# Altium schematic sheet 8.5 WIFI&BT.SchDoc: 6.6kW Daul OBC +11kW WPT
size 508 x 355 mm; Revision: V 1.0; SheetNumber: 13; SheetTotal: 14; ImagePath: 0
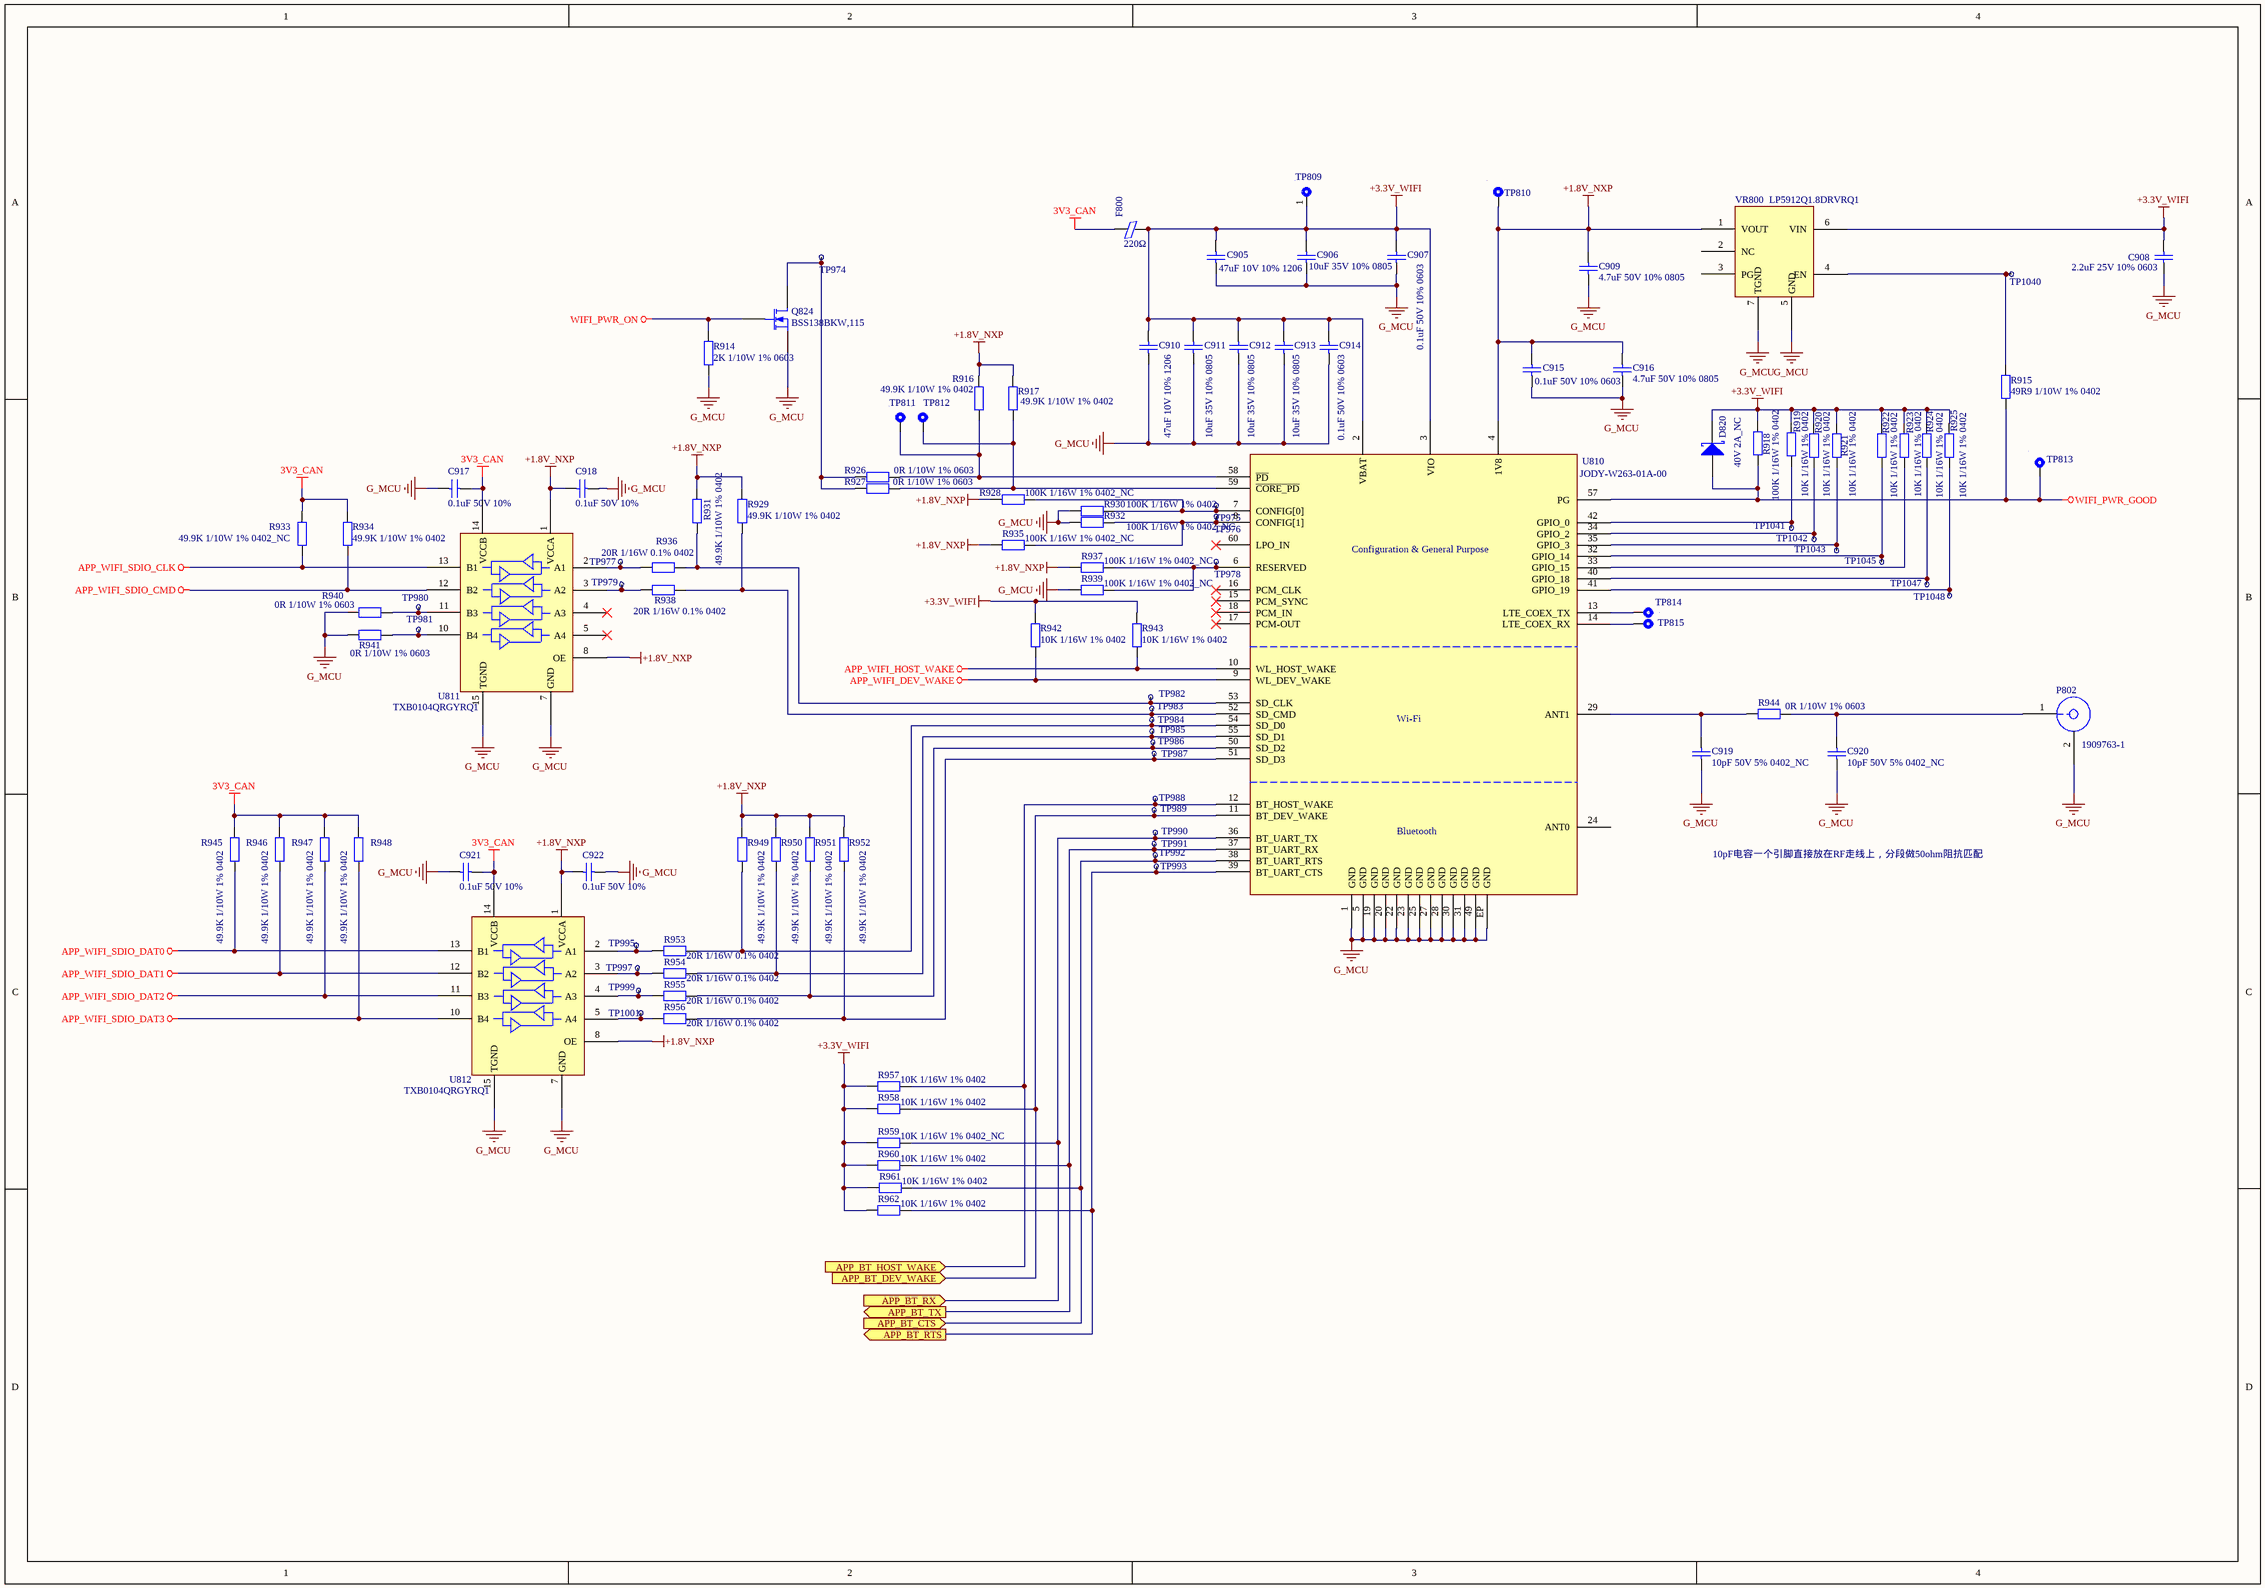
[diagram p0: 8.5 WIFI&BT.SchDoc]

## Parts
C905  47uF 10V 10% 1206  [C1206]
C906  10uF 35V 10% 0805  [C0805]
C907  0.1uF 50V 10% 0603  [C0603]
C908  2.2uF 25V 10% 0603  [C0603]
C909  4.7uF 50V 10% 0805  [C0805]
C910  47uF 10V 10% 1206  [C1206]
C911  10uF 35V 10% 0805  [C0805]
C912  10uF 35V 10% 0805  [C0805]
C913  10uF 35V 10% 0805  [C0805]
C914  0.1uF 50V 10% 0603  [C0603]
C915  0.1uF 50V 10% 0603  [C0603]
C916  4.7uF 50V 10% 0805  [C0805]
C917  0.1uF 50V 10%  [C0603]
C918  0.1uF 50V 10%  [C0603]
C919  10pF 50V 5% 0402_NC  [C0402]
C920  10pF 50V 5% 0402_NC  [C0402]
C921  0.1uF 50V 10%  [C0603]
C922  0.1uF 50V 10%  [C0603]
D820  40V 2A_NC  [SOD123_FL]
F800  值: 220Ω  [R0603]  (hidden comment: 220)
P802  1909763-1  [TE_1909763-1]
Q824  BSS138BKW,115  [SOT323]
R914  2K 1/10W 1% 0603  [R0603]
R915  49R9 1/10W 1% 0402  [R0402]
R916  49.9K 1/10W 1% 0402  [R0402]
R917  49.9K 1/10W 1% 0402  [R0402]
R918  100K 1/16W 1% 0402  [R0402]
R919  10K 1/16W 1% 0402  [R0402]
R920  10K 1/16W 1% 0402  [R0402]
R921  10K 1/16W 1% 0402  [R0402]
R922  10K 1/16W 1% 0402  [R0402]
R923  10K 1/16W 1% 0402  [R0402]
R924  10K 1/16W 1% 0402  [R0402]
R925  10K 1/16W 1% 0402  [R0402]
R926  0R 1/10W 1% 0603  [R0603]
R927  0R 1/10W 1% 0603  [R0603]
R928  100K 1/16W 1% 0402_NC  [R0402]
R929  49.9K 1/10W 1% 0402  [R0402]
R930  100K 1/16W 1% 0402  [R0402]
R931  49.9K 1/10W 1% 0402  [R0402]
R932  100K 1/16W 1% 0402_NC  [R0402]
R933  49.9K 1/10W 1% 0402_NC  [R0402]
R934  49.9K 1/10W 1% 0402  [R0402]
R935  100K 1/16W 1% 0402_NC  [R0402]
R936  20R 1/16W 0.1% 0402  [R0402]
R937  100K 1/16W 1% 0402_NC  [R0402]
R938  20R 1/16W 0.1% 0402  [R0402]
R939  100K 1/16W 1% 0402_NC  [R0402]
R940  0R 1/10W 1% 0603  [R0603]
R941  0R 1/10W 1% 0603  [R0603]
R942  10K 1/16W 1% 0402  [R0402]
R943  10K 1/16W 1% 0402  [R0402]
R944  0R 1/10W 1% 0603  [R0603]
R945  49.9K 1/10W 1% 0402  [R0402]
R946  49.9K 1/10W 1% 0402  [R0402]
R947  49.9K 1/10W 1% 0402  [R0402]
R948  49.9K 1/10W 1% 0402  [R0402]
R949  49.9K 1/10W 1% 0402  [R0402]
R950  49.9K 1/10W 1% 0402  [R0402]
R951  49.9K 1/10W 1% 0402  [R0402]
R952  49.9K 1/10W 1% 0402  [R0402]
R953  20R 1/16W 0.1% 0402  [R0402]
R954  20R 1/16W 0.1% 0402  [R0402]
R955  20R 1/16W 0.1% 0402  [R0402]
R956  20R 1/16W 0.1% 0402  [R0402]
R957  10K 1/16W 1% 0402  [R0402]
R958  10K 1/16W 1% 0402  [R0402]
R959  10K 1/16W 1% 0402_NC  [R0402]
R960  10K 1/16W 1% 0402  [R0402]
R961  10K 1/16W 1% 0402  [R0402]
R962  10K 1/16W 1% 0402  [R0402]
TP809  测试点  [测试点]  (value not drawn)
TP810  测试点  [测试点]  (value not drawn)
TP811  测试点  [测试点]  (value not drawn)
TP812  测试点  [测试点]  (value not drawn)
TP813  测试点  [测试点]  (value not drawn)
TP814  测试点  [测试点]  (value not drawn)
TP815  测试点  [测试点]  (value not drawn)
TP974  测试点  [测试点]  (value not drawn)
TP975  测试点  [测试点]  (value not drawn)
TP976  测试点  [测试点]  (value not drawn)
TP977  测试点  [测试点]  (value not drawn)
TP978  测试点  [测试点]  (value not drawn)
TP979  测试点  [测试点]  (value not drawn)
TP980  测试点  [测试点]  (value not drawn)
TP981  测试点  [测试点]  (value not drawn)
TP982  测试点  [测试点]  (value not drawn)
TP983  测试点  [测试点]  (value not drawn)
TP984  测试点  [测试点]  (value not drawn)
TP985  测试点  [测试点]  (value not drawn)
TP986  测试点  [测试点]  (value not drawn)
TP987  测试点  [测试点]  (value not drawn)
TP988  测试点  [测试点]  (value not drawn)
TP989  测试点  [测试点]  (value not drawn)
TP990  测试点  [测试点]  (value not drawn)
TP991  测试点  [测试点]  (value not drawn)
TP992  测试点  [测试点]  (value not drawn)
TP993  测试点  [测试点]  (value not drawn)
TP995  测试点  [测试点]  (value not drawn)
TP997  测试点  [测试点]  (value not drawn)
TP999  测试点  [测试点]  (value not drawn)
TP1001  测试点  [测试点]  (value not drawn)
TP1040  测试点  [测试点]  (value not drawn)
TP1041  测试点  [测试点]  (value not drawn)
TP1042  测试点  [测试点]  (value not drawn)
TP1043  测试点  [测试点]  (value not drawn)
TP1045  测试点  [测试点]  (value not drawn)
TP1047  测试点  [测试点]  (value not drawn)
TP1048  测试点  [测试点]  (value not drawn)
U810  JODY-W263-01A-00  [UBLOX_JODY-W263]
U811  TXB0104QRGYRQ1  [TI_VQFN-14_RGY]
U812  TXB0104QRGYRQ1  [TI_VQFN-14_RGY]
VR800  LP5912Q1.8DRVRQ1  [TI_WSON-6_DRV]

## Ports
APP_BT_CTS (in), APP_BT_DEV_WAKE (in), APP_BT_HOST_WAKE (in), APP_BT_RTS (out), APP_BT_RX (in), APP_BT_TX (out)

## Nets
3V3_CAN: C917.2 C921.2 F800.1 R933.2 R934.2 R945.2 R946.2 R947.2 R948.2 U811.14(VCCB) U812.14(VCCB)
+1.8V_NXP: C909.2 C915.2 C916.2 C918.1 C922.1 R916.2 R917.2 R928.2 R929.2 R931.2 R935.2 R937.2 R949.2 R950.2 R951.2 R952.2 TP810.1 U810.4(1V8) U811.1(VCCA) U811.8(OE) U812.1(VCCA) U812.8(OE) VR800.1(VOUT)
+3.3V_WIFI: C905.2 C906.2 C907.2 C908.2 C910.2 C911.2 C912.2 C913.2 C914.2 D820.K F800.2 R918.1 R919.2 R920.2 R921.2 R922.2 R923.2 R924.2 R925.2 R942.2 R943.2 R957.2 R958.2 R959.2 R960.2 R961.2 R962.2 TP809.1 U810.2(VBAT) U810.3(VIO) VR800.6(VIN)
APP_WIFI_DEV_WAKE: R942.1 U810.9(WL_DEV_WAKE)
APP_WIFI_HOST_WAKE: R943.1 U810.10(WL_HOST_WAKE)
APP_WIFI_SDIO_CLK: R933.1 U811.13(B1)
APP_WIFI_SDIO_CMD: R934.1 U811.12(B2)
APP_WIFI_SDIO_DAT0: R945.1 U812.13(B1)
APP_WIFI_SDIO_DAT1: R946.1 U812.12(B2)
APP_WIFI_SDIO_DAT2: R947.1 U812.11(B3)
APP_WIFI_SDIO_DAT3: R948.1 U812.10(B4)
G_MCU: C905.1 C906.1 C907.1 C908.1 C909.1 C910.1 C911.1 C912.1 C913.1 C914.1 C915.1 C916.1 C917.1 C918.2 C919.1 C920.1 C921.1 C922.2 P802.2 Q824.S R914.2 R930.2 R932.2 R939.2 R940.2 R941.2 U810.1(GND) U810.5(GND) U810.19(GND) U810.20(GND) U810.22(GND) U810.23(GND) U810.25(GND) U810.27(GND) U810.28(GND) U810.30(GND) U810.31(GND) U810.49(GND) U810.EP(GND) U811.7(GND) U811.15(TGND) U812.7(GND) U812.15(TGND) VR800.5(GND) VR800.7(TGND)
WIFI_PWR_GOOD: D820.A R915.2 R918.2 TP813.1 U810.57(PG)
WIFI_PWR_ON: Q824.G R914.1
APP_BT_CTS: R961.1 TP992.1 U810.38(BT_UART_RTS) ; port APP_BT_CTS
APP_BT_DEV_WAKE: R958.1 TP989.1 U810.11(BT_DEV_WAKE) ; port APP_BT_DEV_WAKE
APP_BT_HOST_WAKE: R957.1 TP988.1 U810.12(BT_HOST_WAKE) ; port APP_BT_HOST_WAKE
APP_BT_RTS: R962.1 TP993.1 U810.39(BT_UART_CTS) ; port APP_BT_RTS
APP_BT_RX: R959.1 TP990.1 U810.36(BT_UART_TX) ; port APP_BT_RX
APP_BT_TX: R960.1 TP991.1 U810.37(BT_UART_RX) ; port APP_BT_TX
NetC919_2: C919.2 R944.1 U810.29(ANT1)
NetC920_2: C920.2 P802.1 R944.2
NetQ824_D: Q824.D R926.2 R927.2 TP974.1
NetR915_1: R915.1 TP1040.1 VR800.4(EN)
NetR916_1: R916.1 R926.1 TP811.1 U810.58(~{PD})
NetR917_1: R917.1 R927.1 TP812.1 U810.59(~{CORE_PD})
NetR919_1: R919.1 TP1041.1 U810.42(GPIO_0)
NetR920_1: R920.1 TP1042.1 U810.34(GPIO_2)
NetR921_1: R921.1 TP1043.1 U810.35(GPIO_3)
NetR922_1: R922.1 TP1045.1 U810.32(GPIO_14)
NetR923_1: R923.1 U810.33(GPIO_15)
NetR924_1: R924.1 TP1047.1 U810.40(GPIO_18)
NetR925_1: R925.1 TP1048.1 U810.41(GPIO_19)
NetR928_1: R928.1 R930.1 TP975.1 U810.7(CONFIG[0])
NetR929_1: R929.1 R938.1 TP983.1 U810.52(SD_CMD)
NetR931_1: R931.1 R936.1 TP982.1 U810.53(SD_CLK)
NetR932_1: R932.1 R935.1 TP976.1 U810.8(CONFIG[1])
NetR936_2: R936.2 TP977.1 U811.2(A1)
NetR937_1: R937.1 R939.1 TP978.1 U810.6(RESERVED)
NetR938_2: R938.2 TP979.1 U811.3(A2)
NetR940_1: R940.1 TP980.1 U811.11(B3)
NetR941_1: R941.1 TP981.1 U811.10(B4)
NetR949_1: R949.1 R953.1 TP984.1 U810.54(SD_D0)
NetR950_1: R950.1 R954.1 TP985.1 U810.55(SD_D1)
NetR951_1: R951.1 R955.1 TP986.1 U810.50(SD_D2)
NetR952_1: R952.1 R956.1 TP987.1 U810.51(SD_D3)
NetR953_2: R953.2 TP995.1 U812.2(A1)
NetR954_2: R954.2 TP997.1 U812.3(A2)
NetR955_2: R955.2 TP999.1 U812.4(A3)
NetR956_2: R956.2 TP1001.1 U812.5(A4)
NetTP814_1: TP814.1 U810.13(LTE_COEX_TX)
NetTP815_1: TP815.1 U810.14(LTE_COEX_RX)

Not connected (* = marked no-connect by the designer): U810 15(PCM_SYNC)* 16(PCM_CLK)* 17(PCM-OUT)* 18(PCM_IN)* 24(ANT0) 60(LPO_IN)*; U811 4(A3)* 5(A4)*; VR800 2(NC) 3(PG)

## Notes on the sheet
- 10pF电容一个引脚直接放在RF走线上，分段做50ohm阻抗匹配
- PROJECT
- SIZE
- APPROVER
- TITLE
- A3
- REV.
- ENGINEER
- DATE
- SHEET
- of
- XCTR-ARD-006(1)-1
- (in symbol JODY-W263-01A-00) Configuration & General Purpose; Wi-Fi; Bluetooth

## Library data of the parts
C905 C910 = Cap Semi: CAP CER 47uF 10V 10% X5R 1206 SMD; 厂商: Murata; 料号: GRM31CR61A476KE15L
C906 = Cap Semi: CAP CER 10uF 35V 10% X5R 0805 SMD; 厂商: CL21A106KBYQNNE; 料号: SAMSUNG
C907 C914 C915 = Cap Semi: CAP CER 0.1uF 50V 10% X7R 0603 SMD; 厂商: SAMSUNG; 料号: CL10B104KB8WPNC
C908 = Cap Semi: CAP CER 2.2uF 25V 10% X5R 0603 SMD; 厂商: Samsung; 料号: CL10A225KA8NNNC
C909 C916 = Cap Semi: CAP CER 4.7uF 50V 10% X7R 0805 SMD; 厂商: Samsung; 料号: CL21Y475KBBVPNE
C911-C913 = Cap Semi: CAP CER 10uF 35V 10% X5R 0805 SMD; 厂商: SAMSUNG; 料号: CL21A106KBYQNNE
C917 C918 C921 C922 = Cap: CAP CER 0.1uF 50V 10% X7R 0603 SMD; 厂商: SAMSUNG; 料号: CL10B104KB8WPNC
C919 C920 = Cap Semi: CAP CER 10pF 50V 5% C0G 0402 SMD; 厂商: *; 料号: *
D820 = D Schottky: SBD 40V 2A Vf=0.65V SOD-123 SMD
F800 = Ferrite Bead 220±25％Ω@100MHz 2.2A 0.05Ω F0603_0.95 BLM18KG221SH1D(Murata): 厂商: MURATA; 品名: Ferrite Bead 220±25％Ω@100MHz 2.2A 0.05Ω F0603_0.95, Murata#BLM18KG221SH1D; 料号: 90-E03L0006; Qualified: AEC-Q200; 温度范围: -55℃~﹢125℃; 重量: 0.005g; 规格: BLM18KG221SH1D(Murata); BCS料号: *; 耐压值: *
P802 = Component_1: Connector, Receptacle, U.FL,  RF/Coaxial, Gold, 50 ohm Jack, DC-6GHZ; 厂商: TE Connectivity; 料号: 1909763-1
Q824 = MOSFET-N: MOSFET N-Channel 60V 320mA SOT-323; 厂商: NXP; 品名: 晶体管; 规格: BSS138BKW,115; 料号: BSS138BKW,115
R914 = Res2: RES Thick Film 2K 1/10W 1% 0603 SMD; 厂商: TA-I; 规格: 2K/0.1W/1%; 料号: RMS06FT2001; 品名: 电阻; 描述: RES Thick Film 2K 1/10W 1% 0603 SMD; 封装: R0603
R915 = Res2: RES Thick Film 49R9 1/10W 1% 0402 SMD; 厂商: YAGEO; 料号: AC0402FR-0749R9L
R916 R917 R929 R931 R945-R951 = Res2: RES Thick Film 49.9K 1/10W 1% 0402 SMD; 厂商: YAGEO; 料号: AC0402FR-0749K9L; 封装: R0402; 描述: RES Thick Film 49.9K 1/10W 1% 0402 SMD; 规格: 49.9K 1/10W 1% 0402
R918 = Res2: RES Thick Film 100K 1/16W 1% 0402 SMD; 厂商: TA-I; 料号: RMH04FT1003
R919-R925 R942 R943 R957-R962 = Res2: RES Thick Film 10K 1/16W 1% 0402 SMD; 厂商: YAGEO; 料号: AC0402FR-0710KL
R926 = Res2: RES Thick Film 0R 1/10W 1% 0603 AEC-Q200 HF SMD; 厂商: TA-I; 位号: R213; 料号: RMS06FT0; 封装: R0603; 描述: RES Thick Film 0R 1/10W 1% 0603 AEC-Q200 HF SMD; 规格: 0R 1/10W 1% 0603
R927 = Res2: RES Thick Film 0R 1/10W 1% 0603 AEC-Q200 HF SMD; 厂商: TA-I; 位号: R214; 料号: RMS06FT0; 封装: R0603; 描述: RES Thick Film 0R 1/10W 1% 0603 AEC-Q200 HF SMD; 规格: 0R 1/10W 1% 0603
R928 R930 R932 R935 R937 R939 = Res2: RES 100K 1/16W 1% 0402 SMD; 厂商: TA-I; 料号: RMH04FT1003
R933 = Res2: RES Thick Film 49.9K 1/10W 1% 0402 SMD; 厂商: YAGEO; 描述: RES 49.9K 1/10W 1% 0402 SMD; 料号: AC0402FR-0749K9L; 位号: R220_NC; 封装: R0402; 规格: 49.9K 1/10W 1% 0402
R934 = Res2: RES Thick Film 49.9K 1/10W 1% 0402 SMD; 厂商: YAGEO; 描述: RES 49.9K 1/10W 1% 0402 SMD.; 料号: AC0402FR-0749K9L; 位号: R221; 封装: R0402; 规格: 49.9K 1/10W 1%
R936 R938 R953-R956 = Res2: RES 20R 1/16W 0.1% 0402 AEC-Q200 SMD; 厂商: YAGEO; 料号: AT0402BRD0720RL
R940 = Res2: RES Thick Film 0R 1/10W 1% 0603 AEC-Q200 HF SMD; 厂商: TA-I; 位号: R227; 料号: RMS06FT0; 封装: R0603; 描述: RES Thick Film 0R 1/10W 1% 0603 AEC-Q200 HF SMD; 规格: 0R 1/10W 1% 0603
R941 = Res2: RES Thick Film 0R 1/10W 1% 0603 AEC-Q200 HF SMD; 厂商: TA-I; 位号: R228; 料号: RMS06FT0; 封装: R0603; 描述: RES Thick Film 0R 1/10W 1% 0603 AEC-Q200 HF SMD; 规格: 0R 1/10W 1% 0603
R944 = Res2: RES Thick Film 0R 1/10W 1% 0603 SMD; 厂商: TA-I; 料号: RMS06FT0
R952 = Res2: RES Thick Film 49.9K 1/10W 1% 0402 SMD; 料号: AC0402FR-0749K9L; 厂商: YAGEO; 规格: 49.9K 1/10W 1% 0402; 描述: RES Thick Film 49.9K 1/10W 1% 0402 SMD; 封装: R0402
TP809-TP815 = Test Point: Test Point 1mm
U810 = JODY-W263-01A-00: IC, Serial-to-WIFI and Bluetooth Module, 2.4GHZ and 5GHZ, 802.11a/b/g/n/ac, Bluetooth 5.0; 封装: UBLOX-JODY-W263; 厂商: Ublox; 描述: IC, Serial-to-WIFI and Bluetooth Module, 2.4GHZ and 5GHZ, 802.11a/b/g/n/ac, Bluetooth 5.0; 规格: JODY-W263-01A-00; 料号: JODY-W263-01A-00
U811 U812 = TXB0104QRGYRQ1: IC Voltage-Level Translator 4-Bit 1.2V~3.6V 1.65V~5.5V TI_VQFN-14-EP(3.5x3.5); 厂商: Texas Instruments; 料号: TXB0104QRGYRQ1
VR800 = LP5912Q1.8DRVRQ1: IC LDO 6.5V 1.8V 500mA AEC-Q100 TI_WSON-6; 封装: WSON-6; 厂商: Texas Instruments; 描述: IC LDO 6.5V 1.8V 500mA AEC-Q100 TI_WSON-6; 规格: LP5912Q1.8DRVRQ1; 料号: LP5912Q1.8DRVRQ1